# Altium schematic sheet Ultra-Mega-PS-Arduino-V1.00.SchDoc: Ultra-Mega-PowerSupply
size A4; Author: Felipe Navarro; SheetNumber: 3; SheetTotal: 5
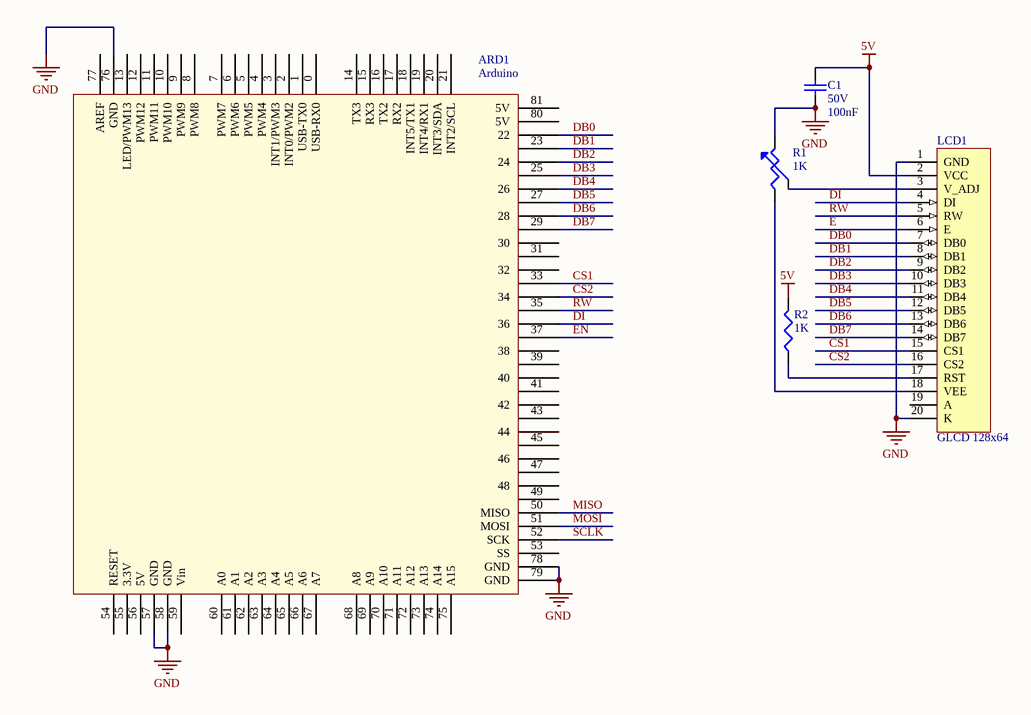
[diagram p0: Ultra-Mega-PS-Arduino-V1.00.SchDoc]

## Parts
ARD1  Arduino  [Arduino]
C1  value 100nF  Tensão: 50V  [CC0603]  (hidden comment: Capacitor Cerâmico)
LCD1  GLCD 128x64  [LCD-128x64]
R1  value 1K  [POT]  (hidden comment: Potenciômetro)
R2  value 1K  [CC0603]  (hidden comment: Resistor)

## Nets
5V: C1.2 LCD1.2(VCC) R2.2
GND: ARD1.57(GND) ARD1.58(GND) ARD1.76(GND) ARD1.78(GND) ARD1.79(GND) C1.1 LCD1.1(GND) LCD1.20(K) R1.1
CS1: ARD1.33 LCD1.15(CS1)
CS2: ARD1.34 LCD1.16(CS2)
DB0: ARD1.22 LCD1.7(DB0)
DB1: ARD1.23 LCD1.8(DB1)
DB2: ARD1.24 LCD1.9(DB2)
DB3: ARD1.25 LCD1.10(DB3)
DB4: ARD1.26 LCD1.11(DB4)
DB5: ARD1.27 LCD1.12(DB5)
DB6: ARD1.28 LCD1.13(DB6)
DB7: ARD1.29 LCD1.14(DB7)
DI: ARD1.36 LCD1.4(DI)
E: LCD1.6(E)
EN: ARD1.37
MISO: ARD1.50(MISO)
MOSI: ARD1.51(MOSI)
RW: ARD1.35 LCD1.5(RW)
SCLK: ARD1.52(SCK)
NetLCD1_3: LCD1.3(V_ADJ) R1.3(TAP)
NetLCD1_17: LCD1.17(RST) R2.1
NetLCD1_18: LCD1.18(VEE) R1.2

Not connected (* = marked no-connect by the designer): ARD1 0(USB-RX0) 1(USB-TX0) 2(INT0/PWM2) 3(INT1/PWM3) 4(PWM4) 5(PWM5) 6(PWM6) 7(PWM7) 8(PWM8) 9(PWM9) 10(PWM10) 11(PWM11) 12(PWM12) 13(LED/PWM13) 14(TX3) 15(RX3) 16(TX2) 17(RX2) 18(INT5/TX1) 19(INT4/RX1) 20(INT3/SDA) 21(INT2/SCL) 30 31 32 38 39 40 41 42 43 44 45 46 47 48 49 53(SS) 54(RESET) 55(3.3V) 56(5V) 59(Vin) 60(A0) 61(A1) 62(A2) 63(A3) 64(A4) 65(A5) 66(A6) 67(A7) 68(A8) 69(A9) 70(A10) 71(A11) 72(A12) 73(A13) 74(A14) 75(A15) 77(AREF) 80(5V) 81(5V); LCD1 19(A)

## Notes on the sheet
- Projeto:
- Tamanho:
- Data:
- A4
- Eng. Felipe Navarro
- Hora:
- Revisão:
- Folha
- de
- Arquivo:

## Library data of the parts
C1 = Cap 100nF 50V 0603 X7R: Capacitor (Semiconductor SIM Model); Chinês: Local; ChinesePrice: 0,00250; Corrente: *A; Potência: *W; Obs:: X7R; Tolerância: ±10%; Supplier 1: Digi-Key; Supplier Part Number 1: 1276-1000-1-ND; ComponentLink1Description: Datasheet; ComponentLink1URL: D:\Tecnoclade\Datasheet\!DataMissing.pdf
LCD1 = LCD12864: GLCD 128x64 SSC12A64DLYY; ChinesePrice: 0,00000; Chinês: ----; Tensão: -0V3 ~ 7V; Value: Display LCD de LED; Obs:: BackLigth = 3V ~ 11V (5V recomendado); Corrente: *; Potência: *; Supplier 1: Digi-Key; Supplier Part Number 1: --LCD; Tolerância: *; ComponentLink1Description: Datasheet; ComponentLink1URL: D:\Tecnoclade\Datasheet\
R1 = Res Trim: Trimmer; ChinesePrice: 0,00000; Chinês: ----; Corrente: *A; Potência: *W; Tensão: *V; Tolerância: ±*%; Supplier 1: Digi-Key; Supplier Part Number 1: --Del; Obs: *; ComponentLink1Description: Datasheet; ComponentLink1URL: D:\Tecnoclade\Datasheet\!DataMissing.pdf
R2 = Res 1K 1% 0603 1/10W: ChinesePrice: 0,00089; Chinês: Local; Corrente: *A; Potência: 1/10W; Tensão: *V; Tolerância: ±1%; Supplier 1: Digi-Key; Supplier Part Number 1: RMCF0603FT1K00CT-ND; Obs: *; ComponentLink1Description: Datasheet; ComponentLink1URL: D:\Tecnoclade\Datasheet\!DataMissing.pdf